# Altium schematic sheet Arduino_DUE_V02b_Template.SchDoc
size Letter
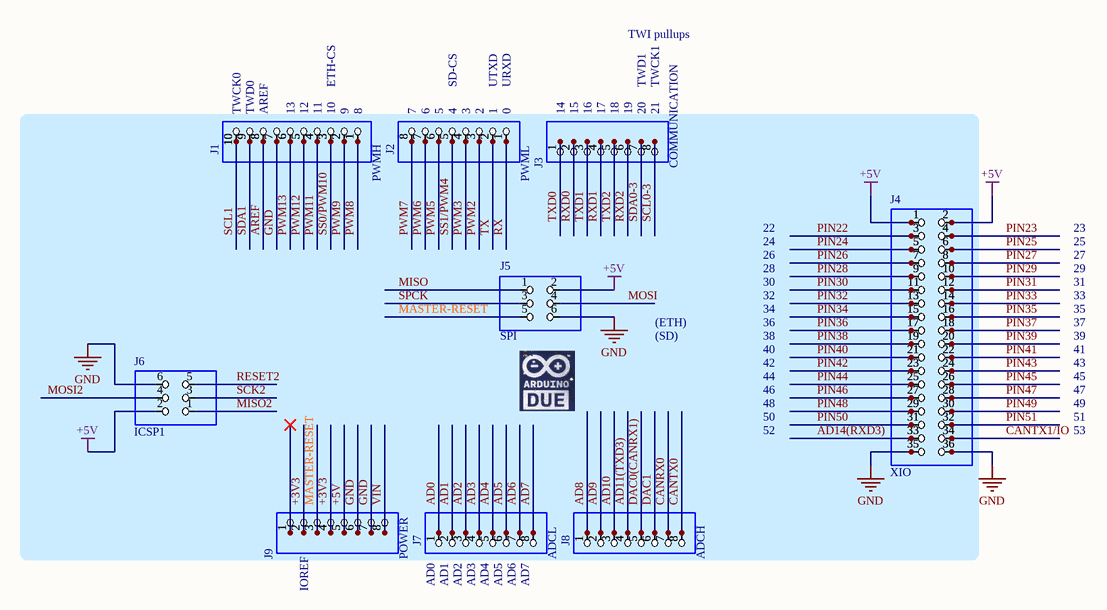
[diagram p0: Arduino_DUE_V02b_Template.SchDoc]

## Parts
J1  PWMH  [1X10]
J2  PWML  [1X08]
J3  COMMUNICATION  [1X08]
J4  XIO  [2X18]
J5  SPI  [2X03]
J6  ICSP1  [2X03]
J7  ADCL  [1X08]
J8  ADCH  [1X08]
J9  POWER  [1X08]

## Nets
+5V: J4.1 J4.2 J5.2 J6.2 J9.5
GND: J1.7 J4.35 J4.36 J5.6 J6.6 J9.6 J9.7
+3V3: J9.2 J9.4
AD0: J7.1
AD1: J7.2
AD2: J7.3
AD3: J7.4
AD4: J7.5
AD5: J7.6
AD6: J7.7
AD7: J7.8
AD8: J8.1
AD9: J8.2
AD10: J8.3
AD11(TXD3): J8.4
AD14(RXD3): J4.33
AREF: J1.8
CANRX0: J8.7
CANTX0: J8.8
CANTX1/IO: J4.34
DAC0(CANRX1): J8.5
DAC1: J8.6
MASTER-RESET: J5.5 J9.3
MISO: J5.1
MISO2: J6.1
MOSI: J5.4
MOSI2: J6.4
PIN22: J4.3
PIN23: J4.4
PIN24: J4.5
PIN25: J4.6
PIN26: J4.7
PIN27: J4.8
PIN28: J4.9
PIN29: J4.10
PIN30: J4.11
PIN31: J4.12
PIN32: J4.13
PIN33: J4.14
PIN34: J4.15
PIN35: J4.16
PIN36: J4.17
PIN37: J4.18
PIN38: J4.19
PIN39: J4.20
PIN40: J4.21
PIN41: J4.22
PIN42: J4.23
PIN43: J4.24
PIN44: J4.25
PIN45: J4.26
PIN46: J4.27
PIN47: J4.28
PIN48: J4.29
PIN49: J4.30
PIN50: J4.31
PIN51: J4.32
PWM2: J2.3
PWM3: J2.4
PWM5: J2.6
PWM6: J2.7
PWM7: J2.8
PWM8: J1.1
PWM9: J1.2
PWM11: J1.4
PWM12: J1.5
PWM13: J1.6
RESET2: J6.5
RX: J2.1
RXD0: J3.2
RXD1: J3.4
RXD2: J3.6
SCK2: J6.3
SCL0-3: J3.8
SCL1: J1.10
SDA0-3: J3.7
SDA1: J1.9
SPCK: J5.3
SS0/PWM10: J1.3
SS1/PWM4: J2.5
TX: J2.2
TXD0: J3.1
TXD1: J3.3
TXD2: J3.5
VIN: J9.8

Not connected (* = marked no-connect by the designer): J9 1*

## Notes on the sheet
- TWI pullups
- (near J1) TWCK0
- (near J1) TWD0
- (near J1) AREF
- (near J1) 13
- (near J1) 12
- (near J1) 11
- (near J1) 10
- (near J1) ETH-CS
- (near J1) 9
- (near J1) 8
- (near J2) 7
- (near J2) 6
- (near J2) 5
- (near J2) 4
- (near J2) SD-CS
- (near J2) 3
- (near J2) 2
- (near J2) 1
- (near J2) UTXD
- (near J2) 0
- (near J2) URXD
- 14
- 15
- (near J3) 16
- (near J3) 17
- (near J3) 18
- (near J3) 19
- (near J3) 20
- TWD1
- (near J3) 21
- TWCK1
- 22
- 24
- 26
- 28
- 23
- 25
- 27
- 29
- (ETH)
- (SD)
- 30
- 32
- 34
- 36
- 38
- 31
- 33
- 35
- 37
- 39
- 48
- 46
- 44
- 42
- 40
- 49
- 47
- 45
- 43
- 41
- 52
- 50
- 51
- 53
- (near J9) IOREF
- (near J7) AD0
- (near J7) AD1
- (near J7) AD2
- (near J7) AD3
- (near J7) AD4
- (near J7) AD5
- (near J7) AD6
- (near J7) AD7

## Library data of the parts
J1 = PINHD-1X10
J2 J3 J7-J9 = PINHD-1X8
J4 = PINHD-2X18
J5 J6 = PINHD-2X3